# Altium schematic sheet Flash Storage.SchDoc
size A; SheetNumber: 2; SheetTotal: 6
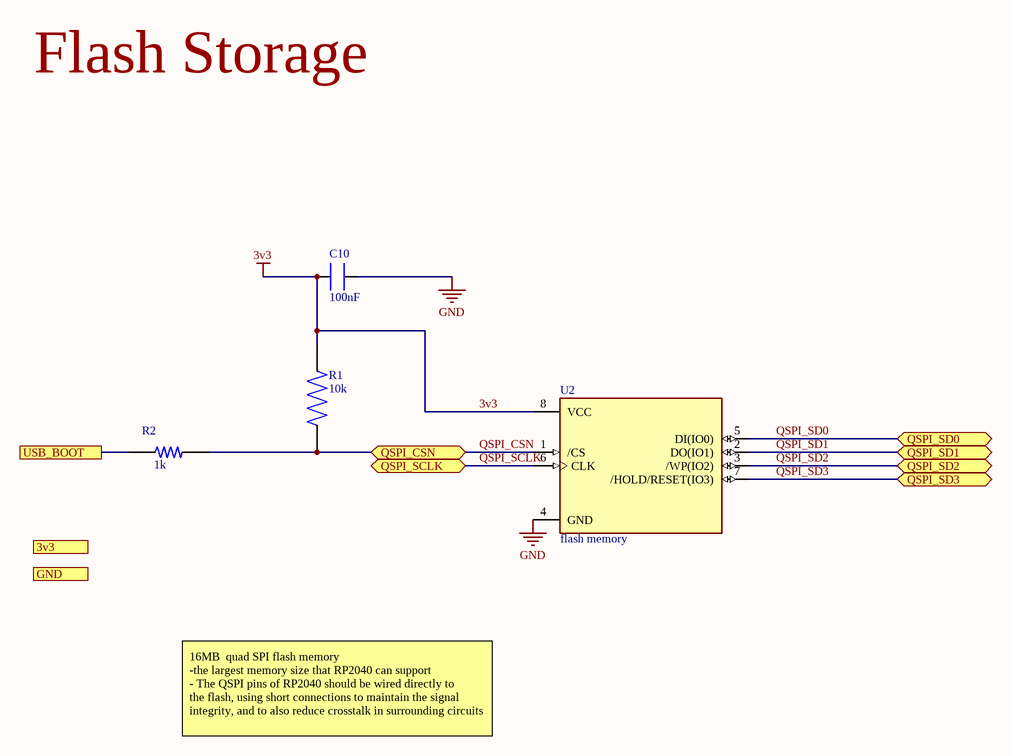
[diagram p0: Flash Storage.SchDoc]

## Parts
C10  100nF  [CL10B104KB8NNNC]
R1  10k  [RMCF0603JT10K0]
R2  1k  [RC0603FR-071KL]
U2  flash memory  [SOIC127P790X216-8N]

## Ports
3v3, GND, QSPI_CSN (bidir), QSPI_SCLK (bidir), QSPI_SD0 (bidir), QSPI_SD1 (bidir), QSPI_SD2 (bidir), QSPI_SD3 (bidir), USB_BOOT

## Nets
3v3: C10.1 R1.2 U2.8(VCC)
GND: C10.2 U2.4(GND)
QSPI_CSN: R1.1 R2.2 U2.1(/CS) ; port QSPI_CSN
QSPI_SCLK: U2.6(CLK) ; port QSPI_SCLK
QSPI_SD0: U2.5(DI(IO0)) ; port QSPI_SD0
QSPI_SD1: U2.2(DO(IO1)) ; port QSPI_SD1
QSPI_SD2: U2.3(/WP(IO2)) ; port QSPI_SD2
QSPI_SD3: U2.7(/HOLD/RESET(IO3)) ; port QSPI_SD3
USB_BOOT: R2.1 ; port USB_BOOT

## Notes on the sheet
- Flash Storage
- 16MB  quad SPI flash memory
  -the largest memory size that RP2040 can support
  - The QSPI pins of RP2040 should be wired directly to
  the flash, using short connections to maintain the signal integrity, and to also reduce crosstalk in surrounding circuits

## Library data of the parts
C10 = CL10B104KB8NNNC: SMD ceramic capacitor 0.1µF, tolerance ±10% 50V 0603 _1608 Metric_; MF: Samsung Electro-Mechanics; Price: None; MP: CL10B104KB8NNNC; SnapEDA_Link: https://www.snapeda.com/parts/CL10B104KB8NNNC/Samsung%20Electro-Mechanics/view-part/3598309/?ref=snap; Availability: Unavailable; Package: 0603 Samsung; Value: *
R1 = RMCF0603JT10K0: 10 kOhms ±5% 0.1W, 1/10W Chip Resistor 0603 (1608 Metric) Automotive AEC-Q200 Thick Film; Package: None; Price: None; Value: *; MP: RMCF0603JT10K0; Availability: Unavailable
R2 = RC0603FR-071KL: 1 kOhms ±1% 0.1W, 1/10W Chip Resistor 0603 (1608 Metric) Moisture Resistant Thick Film; MF: Yageo; SnapEDA_Link: https://www.snapeda.com/parts/RC0603FR-071KL/Yageo/view-part/?ref=snap; Package: 0603 Yageo; Value: *; MP: RC0603FR-071KL; Check_prices: https://www.snapeda.com/parts/RC0603FR-071KL/Yageo/view-part/?ref=eda
U2 = W25Q128JVSIQ: FLASH - NOR Memory IC 128Mb (16M x 8) SPI - Quad I/O, QPI, DTR 133 MHz 8-SOIC; MF: Winbond Electronics; Price: None; Purchase-URL: https://pricing.snapeda.com/search/part/W25Q128JVSIQ/?ref=eda; Check_prices: https://www.snapeda.com/parts/W25Q128JVSIQ/Winbond+Electronics/view-part/?ref=eda; Value: *; MP: W25Q128JVSIQ; Package: SOIC-8 Winbond; SnapEDA_Link: https://www.snapeda.com/parts/W25Q128JVSIQ/Winbond+Electronics/view-part/?ref=snap; Availability: In Stock